# Altium project aSample_biancoSfera.PrjPcb
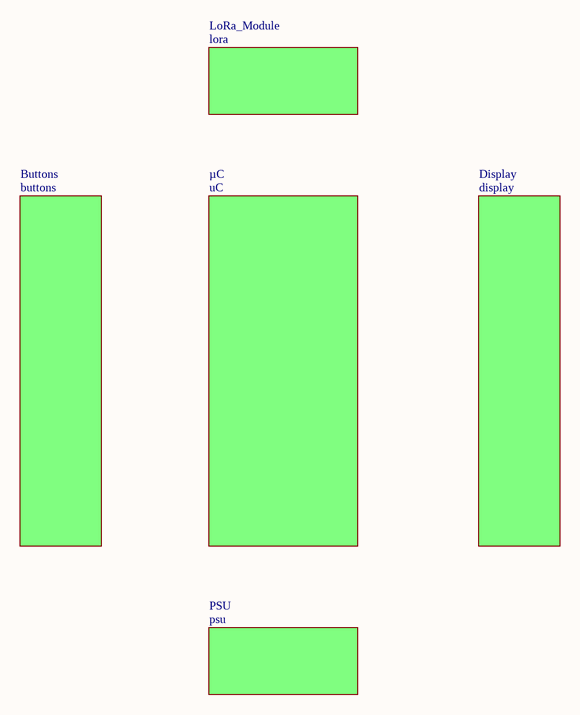
[diagram p0: Overview.SchDoc]
6 sheets, 32 parts. Net scope: flat (ports and power ports of the same name join across sheets).
Sheets:
  Overview.SchDoc
    µC = uC.SchDoc
    PSU = psu.SchDoc
    Display = display.SchDoc
    Buttons = buttons.SchDoc
    LoRa_Module = lora.SchDoc

## Sheet Overview.SchDoc
size A4; SheetNumber: 1; SheetTotal: 6

### Sub-sheets
Buttons = buttons: no entries
Display = display: no entries
LoRa_Module = lora: no entries
PSU = psu: no entries
µC = uC: no entries

## Sheet uC.SchDoc
size A4; SheetNumber: 2; SheetTotal: 6
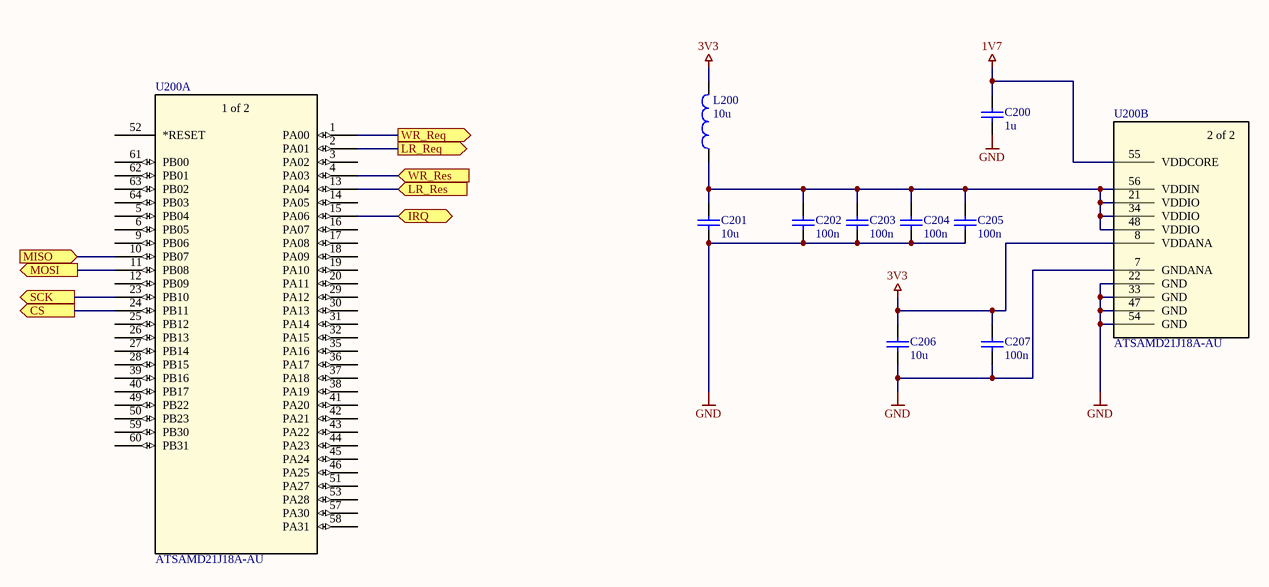
[diagram p1: uC.SchDoc]

### Parts
C200  value 1u  (hidden comment: Capacitor)
C201  value 10u  (hidden comment: Capacitor)
C202  value 100n  (hidden comment: Capacitor)
C203  value 100n  (hidden comment: Capacitor)
C204  value 100n  (hidden comment: Capacitor)
C205  value 100n  (hidden comment: Capacitor)
C206  value 10u  (hidden comment: Capacitor)
C207  value 100n  (hidden comment: Capacitor)
L200  value 10u  (hidden comment: Inductor)
U200  ATSAMD21J18A-AU  [TQFP64_10x10MC_MCH]  (parts A,B of 2)

### Ports
CS (out), IRQ (bidir), LR_Req (out), LR_Res (in), MISO (in), MOSI (out), SCK (out), WR_Req (out), WR_Res (in)

### Nets
1V7: C200.2 U200.55(VDDCORE)
3V3: C206.2 C207.2 L200.2 U200.8(VDDANA)
GND: C200.1 C201.1 C202.1 C203.1 C204.1 C205.1 C206.1 C207.1 U200.7(GNDANA) U200.22(GND) U200.33(GND) U200.47(GND) U200.54(GND)
NetC201_2: C201.2 C202.2 C203.2 C204.2 C205.2 L200.1 U200.21(VDDIO) U200.34(VDDIO) U200.48(VDDIO) U200.56(VDDIN)
NetC501_2: U200.1(PA00) ; port WR_Req
NetC503_2: U200.4(PA03) ; port WR_Res
NetC505_2: U200.2(PA01) ; port LR_Req
NetC507_2: U200.13(PA04) ; port LR_Res
NetU200_10: U200.10(PB07) ; port MISO
NetU200_11: U200.11(PB08) ; port MOSI
NetU200_15: U200.15(PA06) ; port IRQ
NetU200_23: U200.23(PB10) ; port SCK
NetU200_24: U200.24(PB11) ; port CS

Not connected (* = marked no-connect by the designer): U200 3(PA02) 5(PB04) 6(PB05) 9(PB06) 12(PB09) 14(PA05) 16(PA07) 17(PA08) 18(PA09) 19(PA10) 20(PA11) 25(PB12) 26(PB13) 27(PB14) 28(PB15) 29(PA12) 30(PA13) 31(PA14) 32(PA15) 35(PA16) 36(PA17) 37(PA18) 38(PA19) 39(PB16) 40(PB17) 41(PA20) 42(PA21) 43(PA22) 44(PA23) 45(PA24) 46(PA25) 49(PB22) 50(PB23) 51(PA27) 52(*RESET) 53(PA28) 57(PA30) 58(PA31) 59(PB30) 60(PB31) 61(PB00) 62(PB01) 63(PB02) 64(PB03)

### Notes on the sheet
- (in symbol ATSAMD21J18A-AU, part A) 1 of 2
- (in symbol ATSAMD21J18A-AU, part B) 2 of 2

### Library data of the parts
C200-C207 = Capacitor: SimulationGenericComponent: True
L200 = Inductor: SimulationGenericComponent: True
U200 = ATSAMD21J18A-AU: No Description Available; Mfr_Name: Microchip; RefDes: RefDes; Type: Type

## Sheet psu.SchDoc
size A4; SheetNumber: 6; SheetTotal: 6

## Sheet display.SchDoc
size A4; SheetNumber: 4; SheetTotal: 4

## Sheet buttons.SchDoc
size A4; SheetNumber: 5; SheetTotal: 6
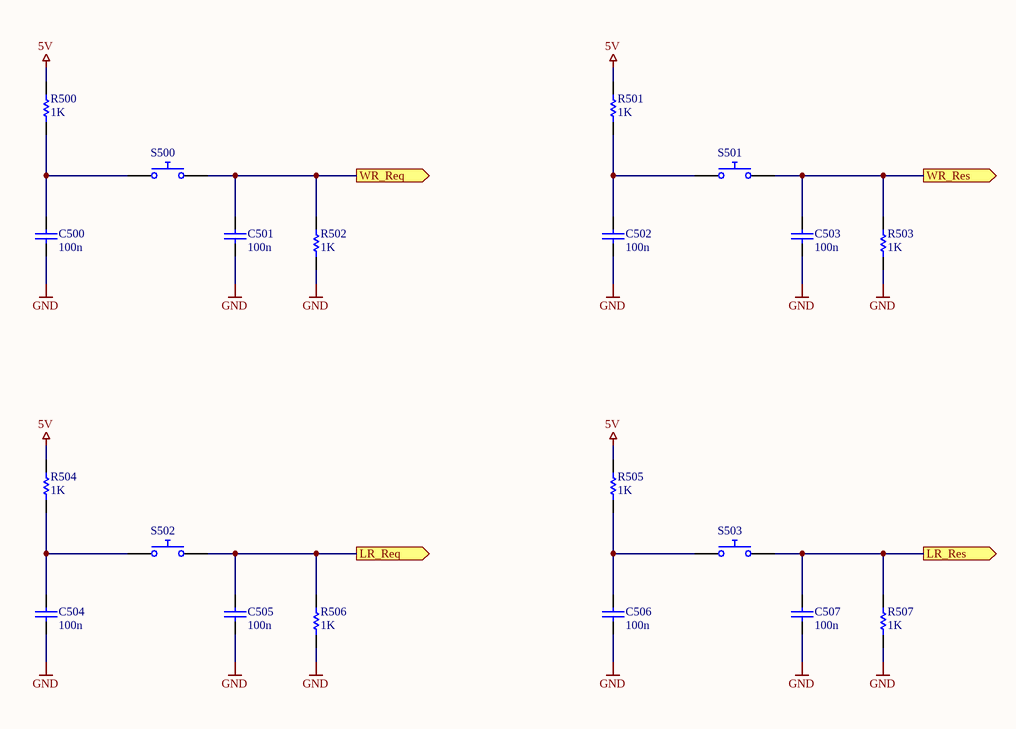
[diagram p2: buttons.SchDoc]

### Parts
C500  value 100n  (hidden comment: Capacitor)
C501  value 100n  (hidden comment: Capacitor)
C502  value 100n  (hidden comment: Capacitor)
C503  value 100n  (hidden comment: Capacitor)
C504  value 100n  (hidden comment: Capacitor)
C505  value 100n  (hidden comment: Capacitor)
C506  value 100n  (hidden comment: Capacitor)
C507  value 100n  (hidden comment: Capacitor)
R500  value 1K  (hidden comment: Resistor)
R501  value 1K  (hidden comment: Resistor)
R502  value 1K  (hidden comment: Resistor)
R503  value 1K  (hidden comment: Resistor)
R504  value 1K  (hidden comment: Resistor)
R505  value 1K  (hidden comment: Resistor)
R506  value 1K  (hidden comment: Resistor)
R507  value 1K  (hidden comment: Resistor)
S500  Push Button Normally Opened  (value not drawn)
S501  Push Button Normally Opened  (value not drawn)
S502  Push Button Normally Opened  (value not drawn)
S503  Push Button Normally Opened  (value not drawn)

### Ports
LR_Req (out), LR_Res (out), WR_Req (out), WR_Res (out)

### Nets
5V: R500.2 R501.2 R504.2 R505.2
GND: C500.1 C501.1 C502.1 C503.1 C504.1 C505.1 C506.1 C507.1 R502.1 R503.1 R506.1 R507.1
NetC500_2: C500.2 R500.1 S500.1
NetC501_2: C501.2 R502.2 S500.2 ; port WR_Req
NetC502_2: C502.2 R501.1 S501.1
NetC503_2: C503.2 R503.2 S501.2 ; port WR_Res
NetC504_2: C504.2 R504.1 S502.1
NetC505_2: C505.2 R506.2 S502.2 ; port LR_Req
NetC506_2: C506.2 R505.1 S503.1
NetC507_2: C507.2 R507.2 S503.2 ; port LR_Res

### Library data of the parts
C500-C507 = Capacitor: SimulationGenericComponent: True
R500-R507 = Resistor: TC1: 0; SimulationGenericComponent: True; TC2: 0
S500-S503 = Push Button NO: closed: 0; Rclosed: 1m; Ropen: 1Meg; SimulationGenericComponent: True

## Sheet lora.SchDoc
size A4; SheetNumber: 3; SheetTotal: 6
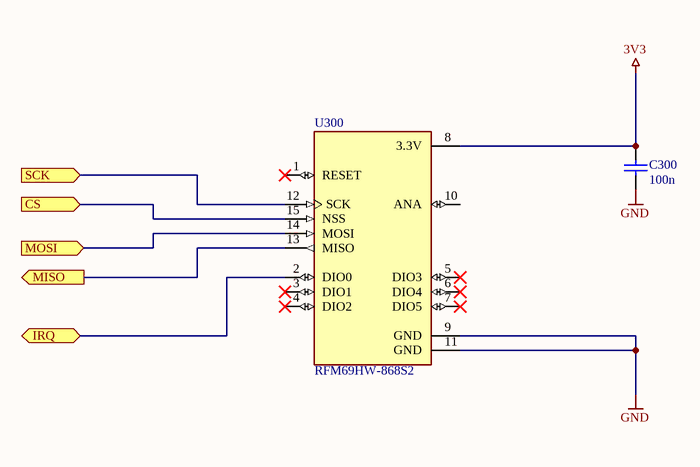
[diagram p3: lora.SchDoc]

### Parts
C300  value 100n  (hidden comment: Capacitor)
U300  RFM69HW-868S2  [XCVR_RFM69HW-868S2]

### Ports
CS (in), IRQ (bidir), MISO (out), MOSI (in), SCK (in)

### Nets
3V3: C300.2 U300.8(3.3V)
GND: C300.1 U300.9(GND) U300.11(GND)
NetU200_10: U300.13(MISO) ; port MISO
NetU200_11: U300.14(MOSI) ; port MOSI
NetU200_15: U300.2(DIO0) ; port IRQ
NetU200_23: U300.12(SCK) ; port SCK
NetU200_24: U300.15(NSS) ; port CS

Not connected (* = marked no-connect by the designer): U300 1(RESET)* 3(DIO1)* 4(DIO2)* 5(DIO3)* 6(DIO4)* 7(DIO5)* 10(ANA)

### Library data of the parts
C300 = Capacitor: SimulationGenericComponent: True
U300 = RFM69HW-868S2: General ISM < 1GHz Transceiver Module 868MHz Antenna Not Included Surface Mount; MF: RF; Package: SMD-16 RF Solutions; Availability: Unavailable; MP: RFM69HW-868S2; Value: *; SnapEDA_Link: https://www.snapeda.com/parts/RFM69HW-868S2/RF%20Solutions/view-part/367203/?ref=snap; Price: None

## Nets that join several sheets
3V3: uC (C206.2 C207.2 L200.2 U200.8), lora (C300.2 U300.8)
GND: uC (13 pins), buttons (12 pins), lora (C300.1 U300.9 U300.11)
NetC501_2: uC (U200.1), buttons (C501.2 R502.2 S500.2)
NetC503_2: uC (U200.4), buttons (C503.2 R503.2 S501.2)
NetC505_2: uC (U200.2), buttons (C505.2 R506.2 S502.2)
NetC507_2: uC (U200.13), buttons (C507.2 R507.2 S503.2)
NetU200_10: uC (U200.10), lora (U300.13)
NetU200_11: uC (U200.11), lora (U300.14)
NetU200_15: uC (U200.15), lora (U300.2)
NetU200_23: uC (U200.23), lora (U300.12)
NetU200_24: uC (U200.24), lora (U300.15)